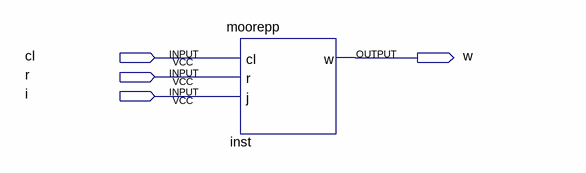
[diagram p0: schematic sheet]
// Quartus schematic Block1.bdf as structural Verilog: 1 symbols, 4 pins
module Block1 (
  input  cl,
  input  r,
  input  i,
  output w
);

  moorepp inst (.cl(cl), .r(r), .j(i), .w(w));
endmodule
